# Altium project Wild FDD V1.1.PrjPcb
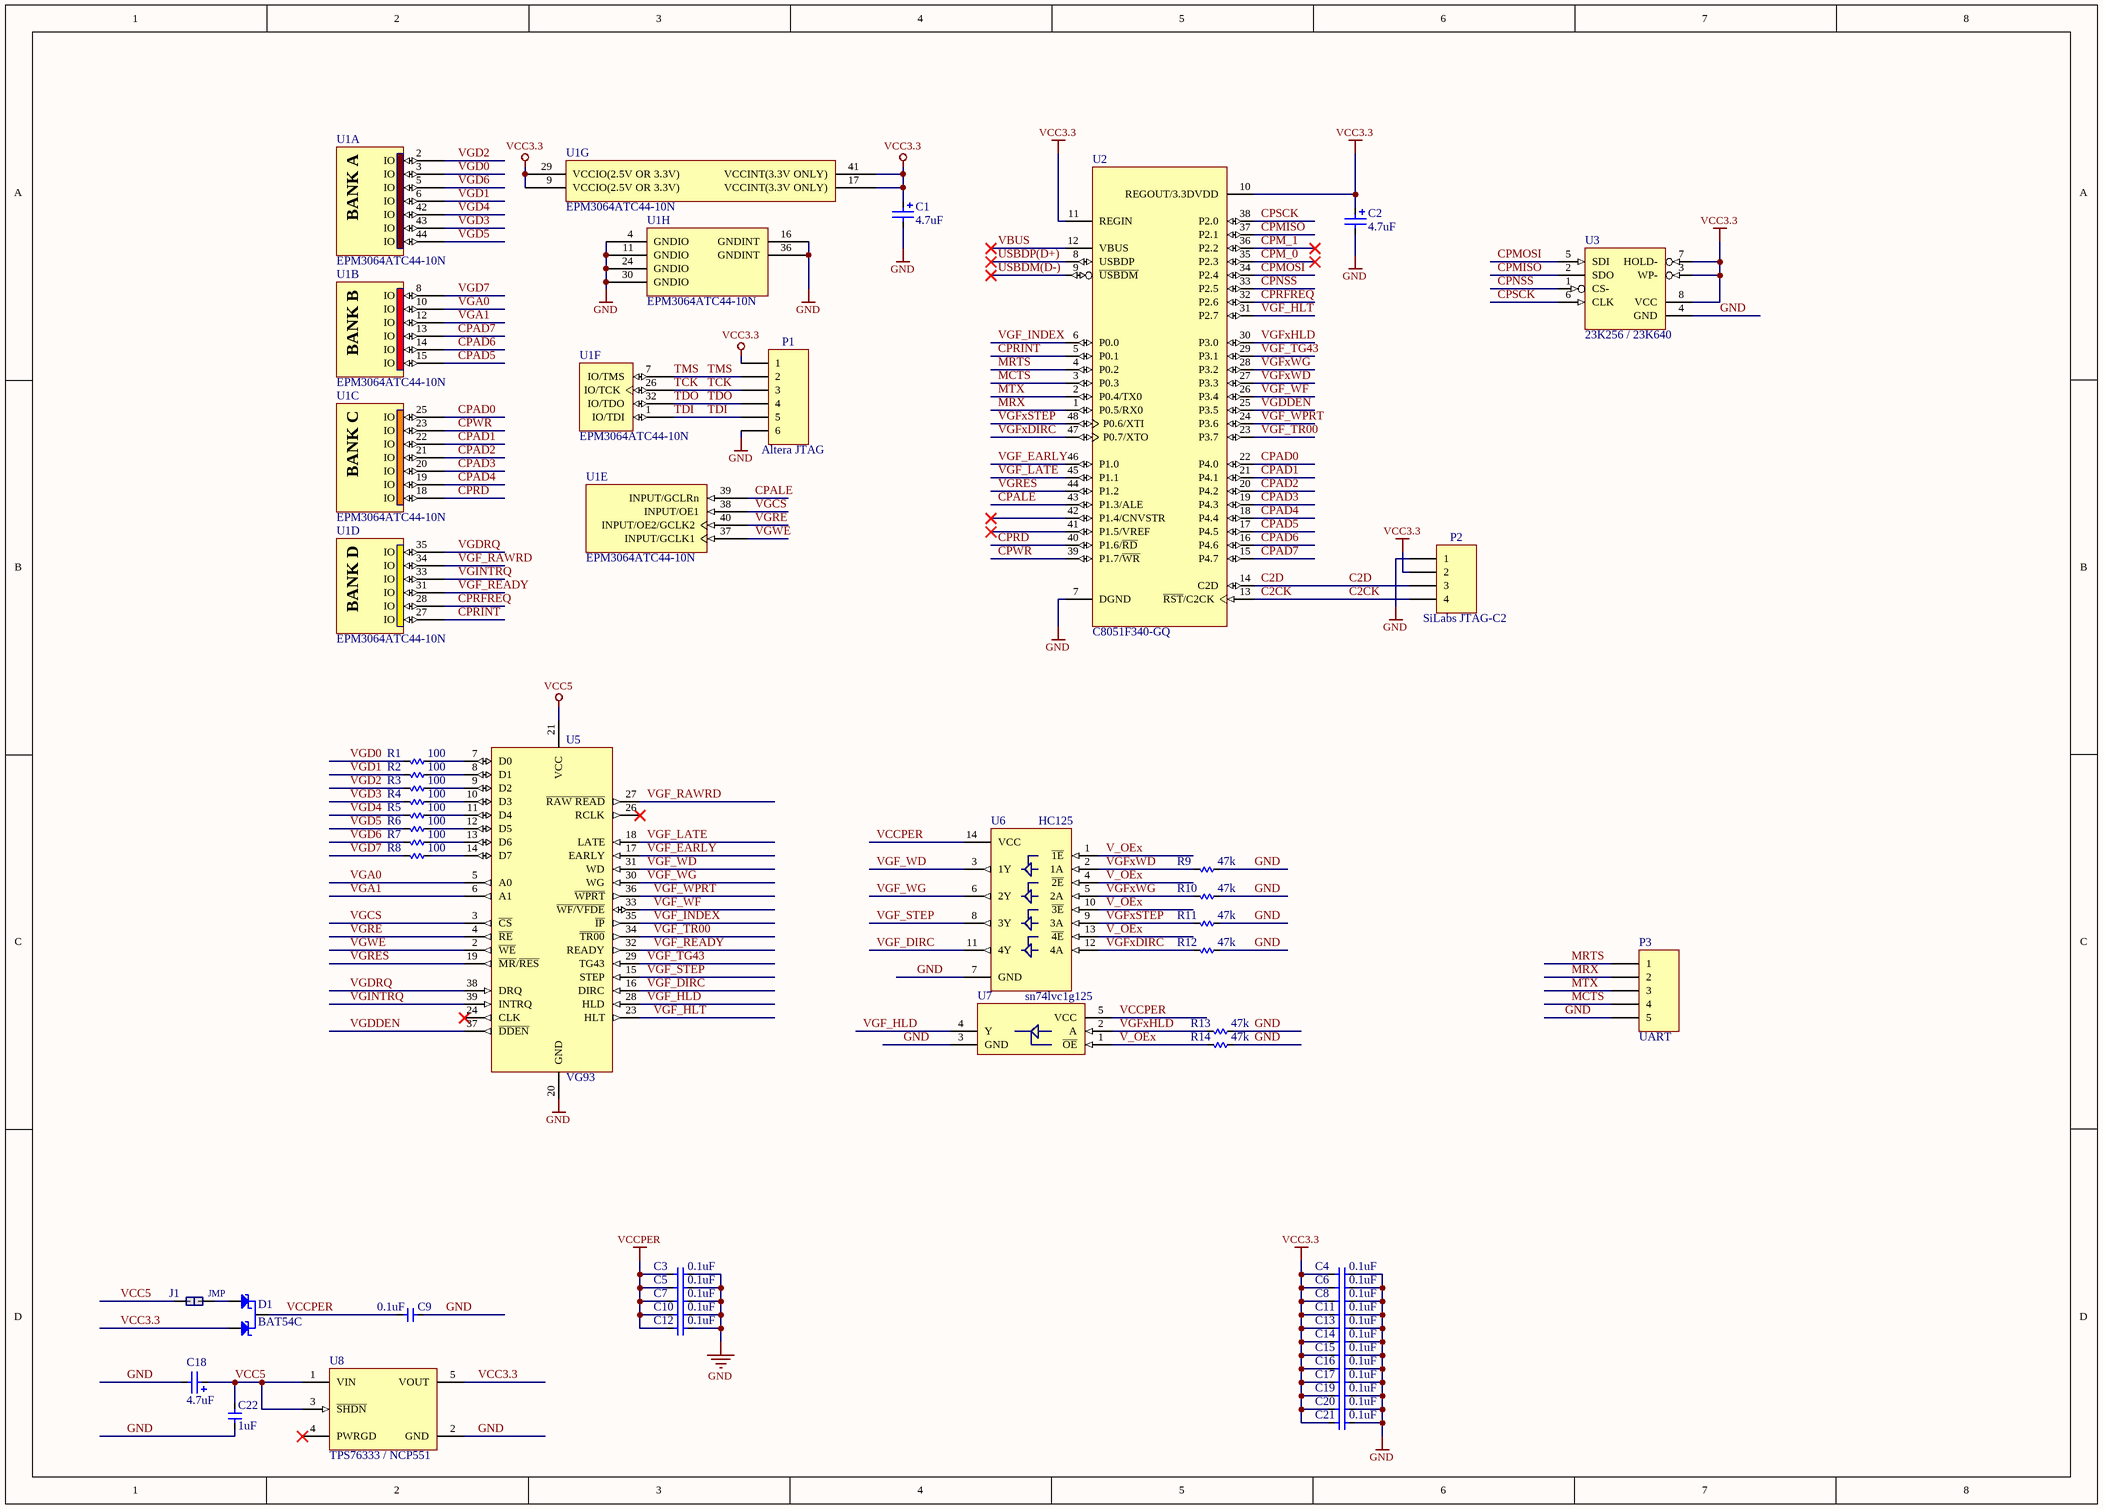
[diagram p0: Wild FDD V1.1.SchDoc]
1 sheet, 48 parts. Net scope: global (net labels, ports and power ports of the same name join across sheets).
Board file: Wild FDD V1.1.PcbDoc

## Sheet Wild FDD V1.1.SchDoc: Digital Key GSM
size A3; Organization: Entire Group; Address1: S.Sosninyh 2v, 88; Address2: Entire Residention; Address3: Kiev; Address4: Ukraine 03148; Revision: 2; SheetNumber: 1; SheetTotal: 2; SheetName: Digital Key; PageSetup: Record=PageOptions|CenterHorizontal=True|CenterVertical=True|PrintScale=0.73|XCorrection=1.00|YCorrection=1.00|PrintKind=0|BorderSize=5000000|LeftOffset=0|BottomOffset=0|Orientation=2|PaperLength=1000|PaperWidth=1000|Scale=100|PaperSource=7|PrintQuality=-4|MediaType=1|DitherType=10|PaperKind=A4|PrintScaleMode=1; ProjectName: Digital Key GSM

### Parts
C1  4.7uF  [CAP_TAN_B]
C2  4.7uF  [CAP_TAN_B]
C3  value 0.1uF  [R1005_CAP]  (hidden comment: CAP)
C4  value 0.1uF  [R1005_CAP]  (hidden comment: CAP)
C5  value 0.1uF  [R1005_CAP]  (hidden comment: CAP)
C6  value 0.1uF  [R1005_CAP]  (hidden comment: CAP)
C7  value 0.1uF  [R1005_CAP]  (hidden comment: CAP)
C8  value 0.1uF  [R1005_CAP]  (hidden comment: CAP)
C9  value 0.1uF  [R1005_CAP]  (hidden comment: CAP)
C10  value 0.1uF  [R1005_CAP]  (hidden comment: CAP)
C11  value 0.1uF  [R1005_CAP]  (hidden comment: CAP)
C12  value 0.1uF  [R1005_CAP]  (hidden comment: CAP)
C13  value 0.1uF  [R1005_CAP]  (hidden comment: CAP)
C14  value 0.1uF  [R1005_CAP]  (hidden comment: CAP)
C15  value 0.1uF  [R1005_CAP]  (hidden comment: CAP)
C16  value 0.1uF  [R1005_CAP]  (hidden comment: CAP)
C17  value 0.1uF  [R1005_CAP]  (hidden comment: CAP)
C18  4.7uF  [CAP_TAN_B]
C19  value 0.1uF  [R1005_CAP]  (hidden comment: CAP)
C20  value 0.1uF  [R1005_CAP]  (hidden comment: CAP)
C21  value 0.1uF  [R1005_CAP]  (hidden comment: CAP)
C22  1uF  [R1608_CAP]
D1  BAT54C  [SOT23-1]
J1  value JMP  [HDR1X2]  (hidden comment: JUMPER)
P1  Altera JTAG  [HDR1X6]
P2  SiLabs JTAG-C2  [HDR1X4]
P3  UART  [HDR1X5]
R1  value 100  [R1608_RES]  (hidden comment: R)
R2  value 100  [R1608_RES]  (hidden comment: R)
R3  value 100  [R1608_RES]  (hidden comment: R)
R4  value 100  [R1608_RES]  (hidden comment: R)
R5  value 100  [R1608_RES]  (hidden comment: R)
R6  value 100  [R1608_RES]  (hidden comment: R)
R7  value 100  [R1608_RES]  (hidden comment: R)
R8  value 100  [R1608_RES]  (hidden comment: R)
R9  value 47k  [R1608_RES]  (hidden comment: R)
R10  value 47k  [R1608_RES]  (hidden comment: R)
R11  value 47k  [R1608_RES]  (hidden comment: R)
R12  value 47k  [R1608_RES]  (hidden comment: R)
R13  value 47k  [R1608_RES]  (hidden comment: R)
R14  value 47k  [R1608_RES]  (hidden comment: R)
U1  EPM3064ATC44-10N  [TQFP44_N]  (parts A,B,C,D,E,F,G,H of 8)
U2  C8051F340-GQ  [TQFP48]
U3  Type: 23K256 / 23K640  [SO8-200]  (hidden comment: FM25CLxx)
U5  VG93  [DIP40_VG93]
U6  HC125  [SO14-150]
U7  sn74lvc1g125  [SOT23-5]
U8  TPS76333 / NCP551  [SOT23-5D]

### Nets
GND: C1.2 C2.2 C3.1 C4.1 C5.1 C6.1 C7.1 C8.1 C9.1 C10.1 C11.1 C12.1 C13.1 C14.1 C15.1 C16.1 C17.1 C18.2 C19.1 C20.1 C21.1 C22.1 P1.6 P2.1 P3.5 R9.1 R10.1 R11.1 R12.1 R13.1 R14.1 U1.4(GNDIO) U1.11(GNDIO) U1.16(GNDINT) U1.24(GNDIO) U1.30(GNDIO) U1.36(GNDINT) U2.7(DGND) U3.4(GND) U5.20(GND) U6.7(GND) U7.3(GND) U8.2(GND)
VCC3.3: C1.1 C2.1 C4.2 C6.2 C8.2 C11.2 C13.2 C14.2 C15.2 C16.2 C17.2 C19.2 C20.2 C21.2 D1.2(A2) P1.1 P2.2 U1.9(VCCIO(2.5V_OR_3.3V)) U1.17(VCCINT(3.3V_ONLY)) U1.29(VCCIO(2.5V_OR_3.3V)) U1.41(VCCINT(3.3V_ONLY)) U2.10(REGOUT/3.3DVDD) U2.11(REGIN) U3.3(WP-) U3.7(HOLD-) U3.8(VCC) U8.5(VOUT)
VCC5: C18.1 C22.2 J1.1(OSC1) U5.21(VCC) U8.1(VIN) U8.3(~{SHDN})
VCCPER: C3.2 C5.2 C7.2 C9.2 C10.2 C12.2 D1.3(K) U6.14(VCC) U7.5(VCC)
C2CK: P2.4 U2.13(~{RST}/C2CK)
C2D: P2.3 U2.14(C2D)
CPAD0: U1.25(IO) U2.22(P4.0)
CPAD1: U1.22(IO) U2.21(P4.1)
CPAD2: U1.21(IO) U2.20(P4.2)
CPAD3: U1.20(IO) U2.19(P4.3)
CPAD4: U1.19(IO) U2.18(P4.4)
CPAD5: U1.15(IO) U2.17(P4.5)
CPAD6: U1.14(IO) U2.16(P4.6)
CPAD7: U1.13(IO) U2.15(P4.7)
CPALE: U1.39(INPUT/GCLRn) U2.43(P1.3/ALE)
CPM_0: U2.35(P2.3)
CPM_1: U2.36(P2.2)
CPMISO: U2.37(P2.1) U3.2(SDO)
CPMOSI: U2.34(P2.4) U3.5(SDI)
CPNSS: U2.33(P2.5) U3.1(CS-)
CPRD: U1.18(IO) U2.40(P1.6/~{RD})
CPRFREQ: U1.28(IO) U2.32(P2.6)
CPRINT: U1.27(IO) U2.5(P0.1)
CPSCK: U2.38(P2.0) U3.6(CLK)
CPWR: U1.23(IO) U2.39(P1.7/~{WR})
MCTS: P3.4 U2.3(P0.3)
MRTS: P3.1 U2.4(P0.2)
MRX: P3.2 U2.1(P0.5/RX0)
MTX: P3.3 U2.2(P0.4/TX0)
TCK: P1.3 U1.26(IO/TCK)
TDI: P1.5 U1.1(IO/TDI)
TDO: P1.4 U1.32(IO/TDO)
TMS: P1.2 U1.7(IO/TMS)
USBDM(D-): U2.9(~{USBDM})
USBDP(D+): U2.8(USBDP)
V_OEx: R14.2 U6.1(~{1E}) U6.4(~{2E}) U6.10(~{3E}) U6.13(~{4E}) U7.1(~{OE})
VBUS: U2.12(VBUS)
VGA0: U1.10(IO) U5.5(A0)
VGA1: U1.12(IO) U5.6(A1)
VGCS: U1.38(INPUT/OE1) U5.3(~{CS})
VGD0: R1.2 U1.3(IO)
VGD1: R2.2 U1.6(IO)
VGD2: R3.2 U1.2(IO)
VGD3: R4.2 U1.43(IO)
VGD4: R5.2 U1.42(IO)
VGD5: R6.2 U1.44(IO)
VGD6: R7.2 U1.5(IO)
VGD7: R8.2 U1.8(IO)
VGDDEN: U2.25(P3.5) U5.37(~{DDEN})
VGDRQ: U1.35(IO) U5.38(DRQ)
VGF_DIRC: U5.16(DIRC) U6.11(4Y)
VGF_EARLY: U2.46(P1.0) U5.17(EARLY)
VGF_HLD: U5.28(HLD) U7.4(Y)
VGF_HLT: U2.31(P2.7) U5.23(HLT)
VGF_INDEX: U2.6(P0.0) U5.35(~{IP})
VGF_LATE: U2.45(P1.1) U5.18(LATE)
VGF_RAWRD: U1.34(IO) U5.27(~{RAW_READ})
VGF_READY: U1.31(IO) U5.32(READY)
VGF_STEP: U5.15(STEP) U6.8(3Y)
VGF_TG43: U2.29(P3.1) U5.29(TG43)
VGF_TR00: U2.23(P3.7) U5.34(~{TR00})
VGF_WD: U5.31(WD) U6.3(1Y)
VGF_WF: U2.26(P3.4) U5.33(~{WF/VFDE})
VGF_WG: U5.30(WG) U6.6(2Y)
VGF_WPRT: U2.24(P3.6) U5.36(~{WPRT})
VGFxDIRC: R12.2 U2.47(P0.7/XTO) U6.12(4A)
VGFxHLD: R13.2 U2.30(P3.0) U7.2(A)
VGFxSTEP: R11.2 U2.48(P0.6/XTI) U6.9(3A)
VGFxWD: R9.2 U2.27(P3.3) U6.2(1A)
VGFxWG: R10.2 U2.28(P3.2) U6.5(2A)
VGINTRQ: U1.33(IO) U5.39(INTRQ)
VGRE: U1.40(INPUT/OE2/GCLK2) U5.4(~{RE})
VGRES: U2.44(P1.2) U5.19(~{MR}/~{RES})
VGWE: U1.37(INPUT/GCLK1) U5.2(~{WE})
NetD1_1: D1.1(A1) J1.2(OSC2)
NetR1_1: R1.1 U5.7(D0)
NetR2_1: R2.1 U5.8(D1)
NetR3_1: R3.1 U5.9(D2)
NetR4_1: R4.1 U5.10(D3)
NetR5_1: R5.1 U5.11(D4)
NetR6_1: R6.1 U5.12(D5)
NetR7_1: R7.1 U5.13(D6)
NetR8_1: R8.1 U5.14(D7)

Not connected (* = marked no-connect by the designer): U2 41(P1.5/VREF)* 42(P1.4/CNVSTR)*; U5 24(CLK)* 26(RCLK)*; U8 4(PWRGD)*

### Notes on the sheet
- Title
- Date:
- File:
- Document
- Time:
- Sheet
- of
- Size:
- A4
- Revision:
- Entire Group
- (in symbol EPM3064ATC44-10N, part A) BANK A
- (in symbol EPM3064ATC44-10N, part B) BANK B
- (in symbol EPM3064ATC44-10N, part C) BANK C
- (in symbol EPM3064ATC44-10N, part D) BANK D

### Library data of the parts
C1 C2 C18 = CAP_TAN_B: CAP TAN Size C; Value: 4.7uF; Revision: July-2002: Re-released for DXP Platform.; Type: *
C3-C17 C19-C22 = CAP: Capacitor; Manufacturer: Generic Components; Class I: Passive; Published: 8-Jun-2000; Revision: July-2002: Re-released for DXP Platform.; Publisher: Altium Limited; Class II: Capacitor; Type: *
  C22: Value: 1uF
D1 = BAT54C: Schottky Barrier Double Diode; Published: 17-Sep-2003; LatestRevisionDate: 12-Dec-2006; LatestRevisionNote: IPC-7351 Footprint Added.; DatasheetVersion: 4-Mar-2002; PackageVersion: May-1999; PackageReference: SOT23; Publisher: Altium Limited; PackageDescription: 3-Pin SOT-23 Package 0.95 mm Pitch, 2.3 mm Lead Span; ComponentLink1Description: Manufacturer Link; ComponentLink1URL: http://www.semiconductors.philips.com/; ComponentLink2Description: Datasheet; ComponentLink2URL: http://www.semiconductors.philips.com/acrobat/datasheets/BAT54_SERIES_4.pdf
J1 = JUMPER: Crystal Oscillator; Manufacturer: Generic Components; Published: 8-Jun-2000; Revision: July-2002: Re-released for DXP Platform.; Publisher: Altium Limited; Class I: Oscillator; Class II: Crystal Oscillator
P1 = Header 6: Header, 6-Pin; LatestRevisionDate: 17-Jul-2002; LatestRevisionNote: Re-released for DXP Platform.; Publisher: Altium Limited
P2 = Header 4: Header, 4-Pin; LatestRevisionDate: 17-Jul-2002; LatestRevisionNote: Re-released for DXP Platform.; Publisher: Altium Limited
P3 = Header 5: Header, 5-Pin; LatestRevisionDate: 17-Jul-2002; LatestRevisionNote: Re-released for DXP Platform.; Publisher: Altium Limited
R1-R14 = R: Resistor; Manufacturer: Generic Components; Class I: Passive; Published: 8-Jun-2000; Revision: July-2002: Re-released for DXP Platform.; Publisher: Altium Limited; Class II: Resistor; Type: *
U1 = EPM3064ATC44-10N: MAX 3064A 3.3V CPLD, 34 IOs, 44-Pin Plastic TFQP, Commercial Temperature, Speed Grade 10, Pb-Free; Published: 4-Mar-2005; LatestRevisionDate: 13-Apr-2006; LatestRevisionNote: IPC-7351 Footprint Added.; DatasheetVersion: ver3.5, Jun-2006; PackageVersion: ver14.3, Jul-2006; PackageReference: TQFP44; Publisher: Altium Limited; PackageDescription: 44-Pin Plastic Thin Quad Flat Pack (TFQP44); Code_JEDEC: MS-026-ACB; ComponentLink1Description: Manufacturer Link; ComponentLink1URL: http://www.altera.com/products/devices/max3k/m3k-index.html; ComponentLink2Description: Datasheet; ComponentLink2URL: http://www.altera.com/literature/ds/m3000a.pdf; ComponentLink3Description: Packaging Specification; ComponentLink3URL: http://www.altera.com/literature/ds/dspkg.pdf
U2 = C8051F340-GQ: USB 8051 Microcontroller, 48MIPS, 64KiB Flash, 256Byte RAM + 4KiB XRAM, 1KiB USB FIFO, 64KiB EMIF, 12MHz +/-0.25% and 80kHz Internal Oscillator, 4-16bit Timer, 20CH 200ksps 10bit ADC, USB 2.0 FS/LS, 2 UART, I2C, SPI, PCA, 2 Comparator, LDO, 40GPIO.; Manufacture: Silicon Laboratories; Compliant: RoHS; CompliantInformationSource: Silicon Laboratries; PackageDocument: 2008-06; TempertureRange: Industrial (-40 to +85Cel); ComponentLink1Description: Manufacture Link; ComponentLink1URL: http://www.silabs.com/; ComponentLink2Description: Datasheet; ComponentLink2URL: https://www.silabs.com/Support Documents/TechnicalDocs/C8051F34x.pdf; DatasheetDocument: Rev. 1.1, 2008-06; PackageReference: TQFP-48; Published: 2006-02-21; Publisher: A and A System Co., Ltd.; DigiKeyPartNumber: 336-1298-ND
U3 = FM25CLxx: FRAM SPI
U5 = VG93: Connector For Wild FDD; Make: Entire Group
U6 = HC125: Quad buffer/line driver 3-state; Published: 8-Jun-2000; LatestRevisionDate: 13-Apr-2006; LatestRevisionNote: IPC-7351 Footprint Added.; DatasheetVersion: Oct-1993; PackageVersion: May-1998; PackageReference: SO16; Publisher: Altium Limited; PackageDescription: 16-Pin Small Outline Integrated Circuit 1.27 mm Pitch; Code_IPC: SOIC127P600-16; ComponentLink1Description: Manufacturer Link; ComponentLink1URL: http://www.st.com/; ComponentLink2Description: Datasheet; ComponentLink2URL: http://www.st.com/stonline/products/literature/ds/7731/m74hc4053.pdf
U7 = sn74lvc1g125: Single Buffer/Driver With Open-Drain Output; Published: 29-Jan-2009; DatasheetVersion: revA, Aug-2007; PackageVersion: revAW, Oct-2008; PackageReference: SOT-23-OT5; Publisher: Altium Limited; PackageDescription: 5-Lead Plastic Small Outline Transistor (OT) [SOT-23]; Code_IPC: SOT23-5; ComponentLink1Description: Manufacturer Link; ComponentLink1URL: http://www.microchip.com; ComponentLink2Description: Datasheet; ComponentLink2URL: http://ww1.microchip.com/downloads/en/DeviceDoc/22070a.pdf; ComponentLink3Description: Packaging Specification; ComponentLink3URL: http://ww1.microchip.com/downloads/en/PackagingSpec/00049AW.pdf
U8 = TPS76333: 300 mA, Low Voltage, Low Quiescent Current LDO Regulator, 5-Pin SOT-23, Extended Temperature, Tape and Reel; Published: 29-Jan-2009; DatasheetVersion: revA, Aug-2007; PackageVersion: revAW, Oct-2008; PackageReference: SOT-23-OT5; Publisher: Altium Limited; PackageDescription: 5-Lead Plastic Small Outline Transistor (OT) [SOT-23]; Code_IPC: SOT23-5; ComponentLink1Description: Manufacturer Link; ComponentLink1URL: http://www.microchip.com; ComponentLink2Description: Datasheet; ComponentLink2URL: http://ww1.microchip.com/downloads/en/DeviceDoc/22070a.pdf; ComponentLink3Description: Packaging Specification; ComponentLink3URL: http://ww1.microchip.com/downloads/en/PackagingSpec/00049AW.pdf